# Altium schematic sheet Control_Schem.SchDoc (part 4 of 5)
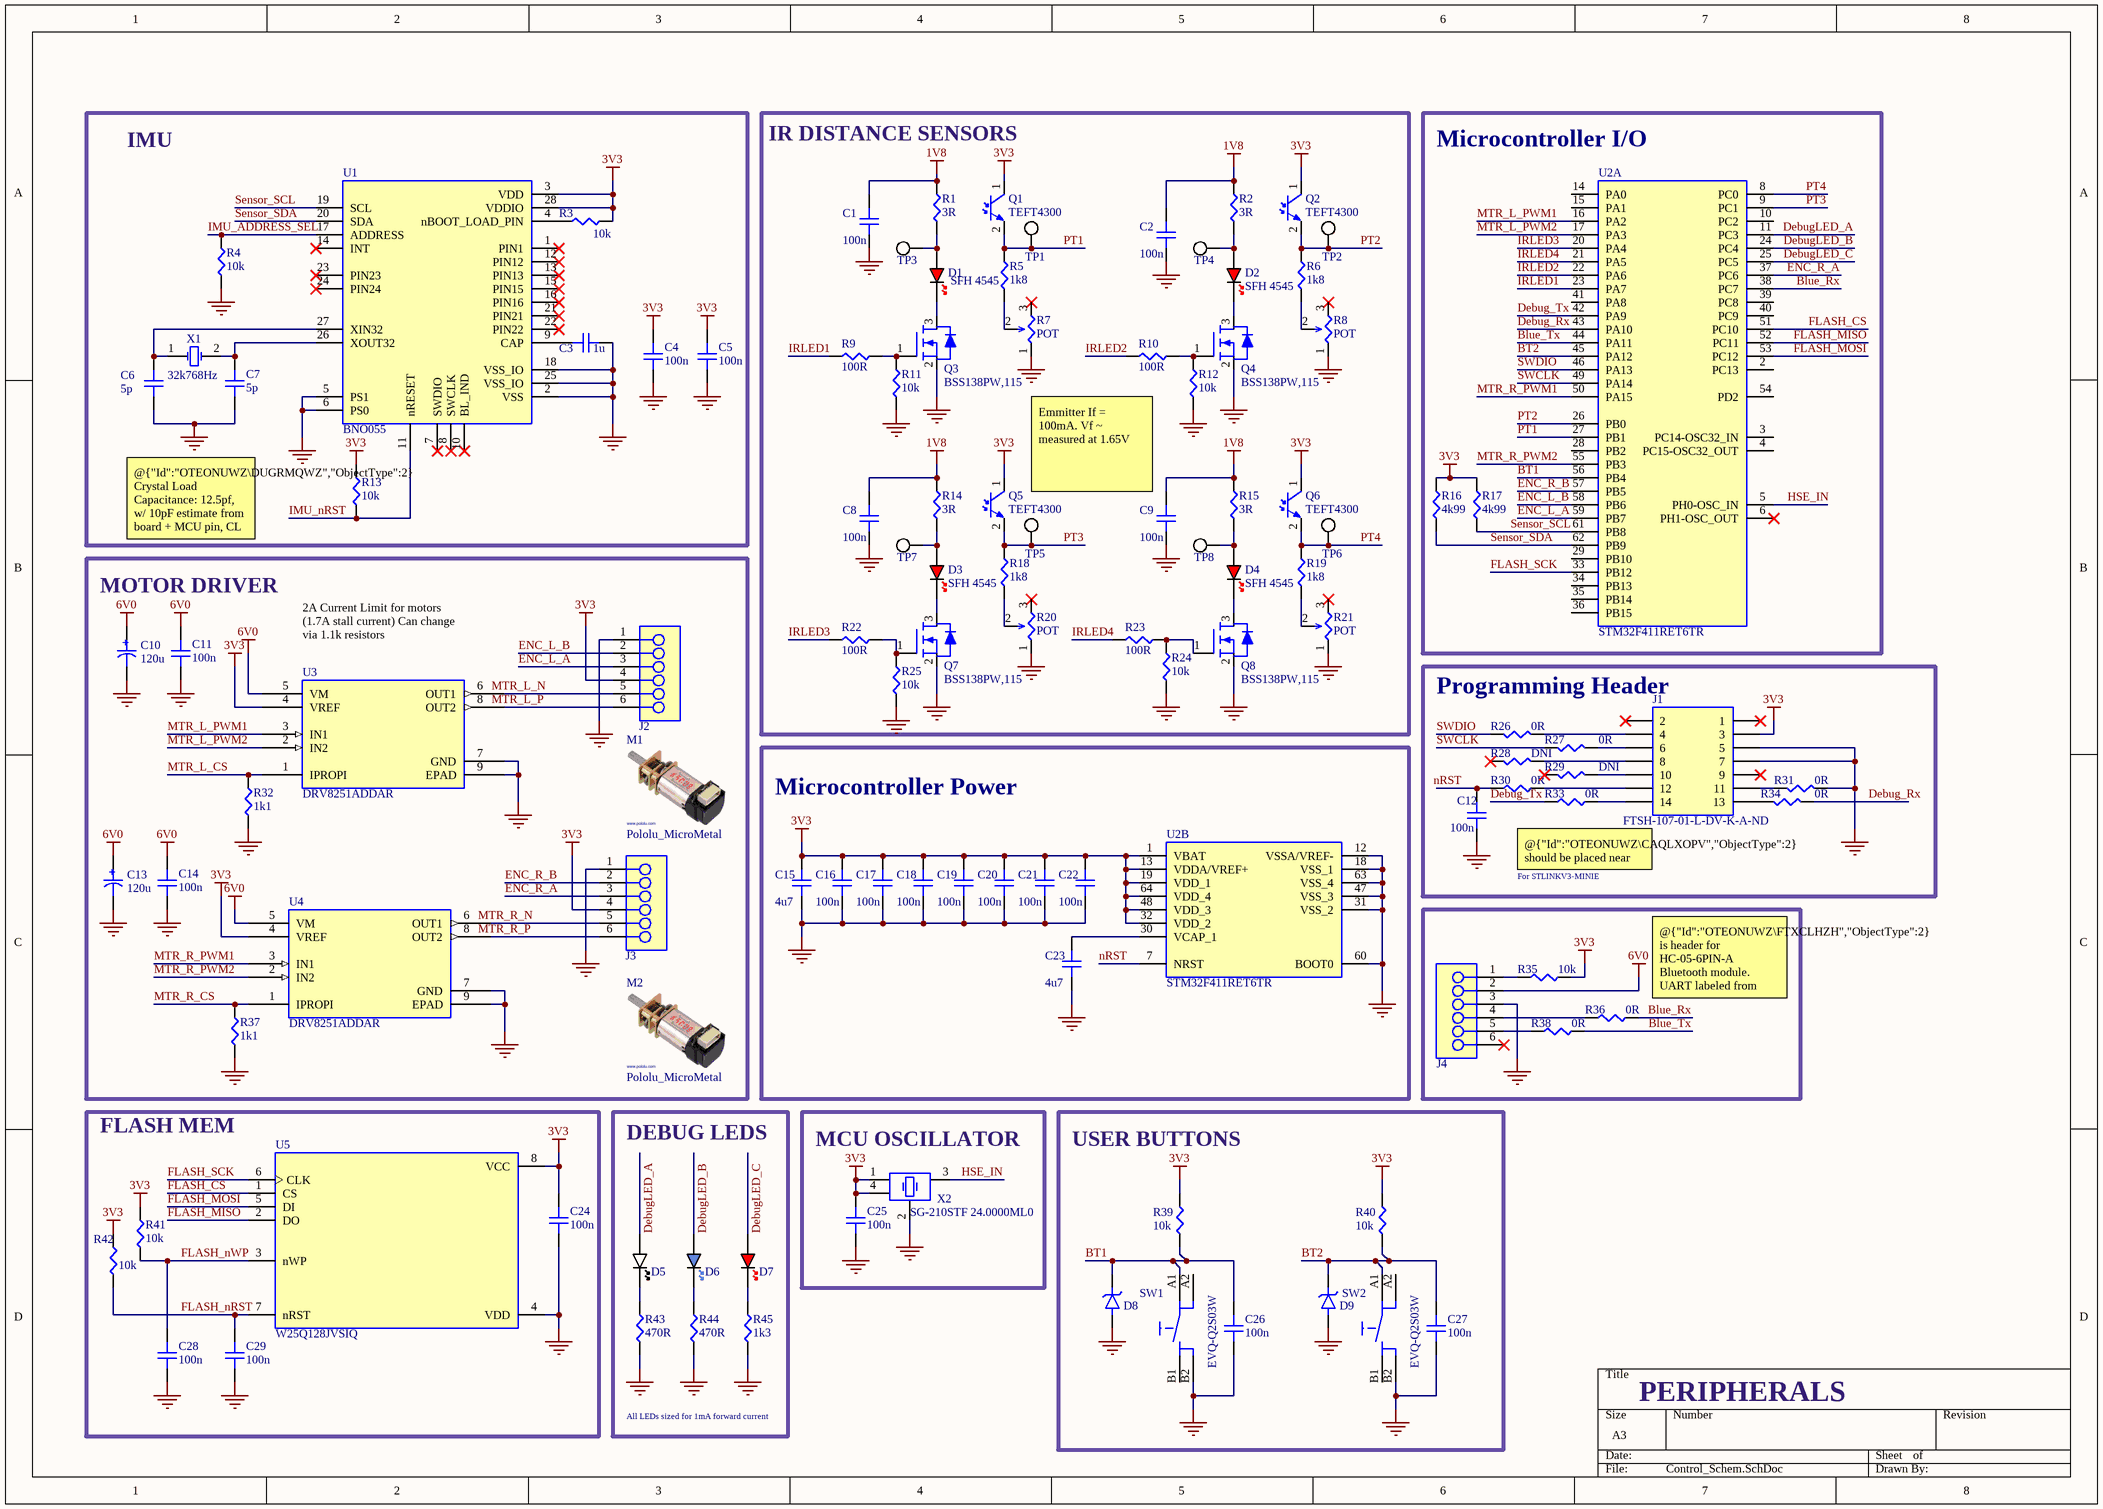
[diagram p3: Control_Schem.SchDoc]

## Library data of the parts (continued)
R35 = RES: 100mW Thick Film Resistors ±100ppm/℃ ±1% 10kΩ 0603 Chip Resistor - Surface Mount ROHS; Manufacturer: Stackpole Electronics; Manufacturer Part Number: RNCP0603FTD49R9; Max Power Dissipation: 125mW; Temperature Coefficient: 100ppm/°C; Voltage Rating: 150V; Voltage Rating (DC): 50V; Value: 10k; Supplier 1: Verical; Supplier Part Number: RNCP0603FTD49R9; RoHS: Compliant; Category: Chip SMD Resistors; Stock: 245000; Pricing: 5000=0.0152 (USD); Case/Package: 0603; Case Code (Imperial): 0603; Case Code (Metric): 1608; Composition: Thin Film; Features: Anti-Sulfur, Moisture Resistant; Height: 400µm; Lead Free: Lead Free; Length: 1.4986mm; Lifecycle Status: Production; Max Operating Temperature: 155°C; Min Operating Temperature: -55°C; Mounting Technology: Surface Mount; Number of Terminals: 2; Number of Terminations: 2; Packaging: Cut Tape (CT); Power Dissipation: 125mW; Power Rating: 125mW; REACH SVHC: Yes; Schedule B: 8533210045, 8533210045|8533210045, 8533210045|8533210045|8533210045, 8533210045|8533210045|8533210045|8533210045; Tolerance: 1%; Width: 800µm; Working Voltage: 150V; ComponentLink1URL: https://datasheet.octopart.com:443/RNCP0603FTD49R9-Stackpole-Electronics-datasheet-182148179.pdf?src-supplier=IHS; ComponentLink1Description: https://datasheet.octopart.com:443/RNCP0603FTD49R9-Stackpole-Electronics-datasheet-182148179.pdf?src-supplier=IHS; ComponentLink2URL: https://datasheet.octopart.com:443/RNCP0603FTD49R9-Stackpole-Electronics-datasheet-149178200.pdf?src-supplier=Upverter; ComponentLink2Description: https://datasheet.octopart.com:443/RNCP0603FTD49R9-Stackpole-Electronics-datasheet-149178200.pdf?src-supplier=Upverter; ComponentLink3URL: https://datasheet.octopart.com:443/RNCP0603FTD49R9-Stackpole-Electronics-datasheet-141193801.pdf?src-supplier=Future+Electronics; ComponentLink3Description: https://datasheet.octopart.com:443/RNCP0603FTD49R9-Stackpole-Electronics-datasheet-141193801.pdf?src-supplier=Future+Electronics; ComponentLink4URL: https://datasheet.octopart.com:443/RNCP0603FTD49R9-Stackpole-Electronics-datasheet-38896780.pdf?src-supplier=Future+Electronics; ComponentLink4Description: https://datasheet.octopart.com:443/RNCP0603FTD49R9-Stackpole-Electronics-datasheet-38896780.pdf?src-supplier=Future+Electronics; ComponentLink5URL: http://sigma.octopart.com:80/15942470/materials_sheet/Stackpole-Electronics-RNCP0603FTD49R9.pdf?src-supplier=Compliance+Statements; ComponentLink5Description: http://sigma.octopart.com:80/15942470/materials_sheet/Stackpole-Electronics-RNCP0603FTD49R9.pdf?src-supplier=Compliance+Statements; ComponentLink6URL: http://sigma.octopart.com:80/141158211/reach_statement/Stackpole-Electronics-RNCP0603FTD49R9.pdf?src-supplier=Compliance+Statements; ComponentLink6Description: http://sigma.octopart.com:80/141158211/reach_statement/Stackpole-Electronics-RNCP0603FTD49R9.pdf?src-supplier=Compliance+Statements; ComponentLink7URL: http://sigma.octopart.com:80/141158212/rohs_statement/Stackpole-Electronics-RNCP0603FTD49R9.pdf?src-supplier=Compliance+Statements; ComponentLink7Description: http://sigma.octopart.com:80/141158212/rohs_statement/Stackpole-Electronics-RNCP0603FTD49R9.pdf?src-supplier=Compliance+Statements; Supplier Part Number 1: RC0603FR-0710KL; China RoHS: Non-Compliant; Contact Plating: Tin; Depth: 800µm; Lead Pitch: 300µm; Military Standard: Not; Pins: 2; Radiation Hardening: No; Termination: SMD/SMT; Weight: 2.012816mg; ComponentLink8URL: https://datasheet.octopart.com:443/RC0603FR-0710KL-Yageo-datasheet-175887523.pdf?src-supplier=IHS; ComponentLink8Description: https://datasheet.octopart.com:443/RC0603FR-0710KL-Yageo-datasheet-175887523.pdf?src-supplier=IHS; ComponentLink9URL: https://datasheet.octopart.com:443/RC0603FR-0710KL-Yageo-datasheet-103092701.pdf?src-supplier=Upverter; ComponentLink9Description: https://datasheet.octopart.com:443/RC0603FR-0710KL-Yageo-datasheet-103092701.pdf?src-supplier=Upverter; ComponentLink10URL: https://datasheet.octopart.com:443/RC0603FR-0710KL-Yageo-datasheet-98239111.pdf?src-supplier=Upverter; ComponentLink10Description: https://datasheet.octopart.com:443/RC0603FR-0710KL-Yageo-datasheet-98239111.pdf?src-supplier=Upverter; ComponentLink11URL: https://datasheet.octopart.com:443/RC0603FR-0710KL-Yageo-datasheet-141265859.pdf?src-supplier=Upverter; ComponentLink11Description: https://datasheet.octopart.com:443/RC0603FR-0710KL-Yageo-datasheet-141265859.pdf?src-supplier=Upverter; ComponentLink12URL: https://sigma.octopart.com:443/138820526/technical_drawing/Yageo-RC0603FR-0710KL.pdf?src-supplier=Upverter; ComponentLink12Description: https://sigma.octopart.com:443/138820526/technical_drawing/Yageo-RC0603FR-0710KL.pdf?src-supplier=Upverter; ComponentLink13URL: https://datasheet.octopart.com:443/RC0603FR-0710KL-Yageo-datasheet-8328172.pdf?src-supplier=Farnell; ComponentLink13Description: https://datasheet.octopart.com:443/RC0603FR-0710KL-Yageo-datasheet-8328172.pdf?src-supplier=Farnell; ComponentLink14URL: https://datasheet.octopart.com:443/RC0603FR-0710KL-Yageo-datasheet-13691069.pdf?src-supplier=Farnell; ComponentLink14Description: https://datasheet.octopart.com:443/RC0603FR-0710KL-Yageo-datasheet-13691069.pdf?src-supplier=Farnell; ComponentLink15URL: https://datasheet.octopart.com:443/RC0603FR-0710KL-Yageo-datasheet-62067350.pdf?src-supplier=element14+APAC; ComponentLink15Description: https://datasheet.octopart.com:443/RC0603FR-0710KL-Yageo-datasheet-62067350.pdf?src-supplier=element14+APAC; ComponentLink16URL: https://datasheet.octopart.com:443/RC0603FR-0710KL-Yageo-datasheet-17842380.pdf?src-supplier=element14+APAC; ComponentLink16Description: https://datasheet.octopart.com:443/RC0603FR-0710KL-Yageo-datasheet-17842380.pdf?src-supplier=element14+APAC; ComponentLink17URL: https://datasheet.octopart.com:443/RC0603FR-0710KL-Yageo-datasheet-15599030.pdf?src-supplier=Future+Electronics; ComponentLink17Description: https://datasheet.octopart.com:443/RC0603FR-0710KL-Yageo-datasheet-15599030.pdf?src-supplier=Future+Electronics; ComponentLink18URL: https://datasheet.octopart.com:443/RC0603FR-0710KL-Yageo-Group-datasheet-176638170.pdf?src-supplier=Future+Electronics; ComponentLink18Description: https://datasheet.octopart.com:443/RC0603FR-0710KL-Yageo-Group-datasheet-176638170.pdf?src-supplier=Future+Electronics; ComponentLink19URL: https://datasheet.octopart.com:443/RC0603FR-0710KL-Yageo-datasheet-164759695.pdf?src-supplier=Future+Electronics; ComponentLink19Description: https://datasheet.octopart.com:443/RC0603FR-0710KL-Yageo-datasheet-164759695.pdf?src-supplier=Future+Electronics; ComponentLink20URL: https://datasheet.octopart.com:443/RC0603FR-0710KL-Yageo-datasheet-127823281.pdf?src-supplier=Future+Electronics; ComponentLink20Description: https://datasheet.octopart.com:443/RC0603FR-0710KL-Yageo-datasheet-127823281.pdf?src-supplier=Future+Electronics; ComponentLink21URL: https://datasheet.octopart.com:443/RC0603FR-0710KL-Yageo-datasheet-137700087.pdf?src-supplier=Future+Electronics; ComponentLink21Description: https://datasheet.octopart.com:443/RC0603FR-0710KL-Yageo-datasheet-137700087.pdf?src-supplier=Future+Electronics; ComponentLink22URL: https://datasheet.octopart.com:443/RC0603FR-0710KL-Yageo-datasheet-27584510.pdf?src-supplier=Future+Electronics; ComponentLink22Description: https://datasheet.octopart.com:443/RC0603FR-0710KL-Yageo-datasheet-27584510.pdf?src-supplier=Future+Electronics; ComponentLink23URL: https://datasheet.octopart.com:443/RC0603FR-0710KL-Yageo-datasheet-8324193.pdf?src-supplier=Future+Electronics; ComponentLink23Description: https://datasheet.octopart.com:443/RC0603FR-0710KL-Yageo-datasheet-8324193.pdf?src-supplier=Future+Electronics; ComponentLink24URL: https://datasheet.octopart.com:443/RC0603FR-0710KL-Yageo-datasheet-12596169.pdf?src-supplier=Newark; ComponentLink24Description: https://datasheet.octopart.com:443/RC0603FR-0710KL-Yageo-datasheet-12596169.pdf?src-supplier=Newark; ComponentLink25URL: https://datasheet.octopart.com:443/RC0603FR-0710KL-Yageo-datasheet-503470.pdf?src-supplier=Newark; ComponentLink25Description: https://datasheet.octopart.com:443/RC0603FR-0710KL-Yageo-datasheet-503470.pdf?src-supplier=Newark; ComponentLink26URL: https://datasheet.octopart.com:443/RC0603FR-0710KL-Yageo-datasheet-34211833.pdf?src-supplier=Newark; ComponentLink26Description: https://datasheet.octopart.com:443/RC0603FR-0710KL-Yageo-datasheet-34211833.pdf?src-supplier=Newark; ComponentLink27URL: https://datasheet.octopart.com:443/RC0603FR-0710KL-Yageo-datasheet-79472498.pdf?src-supplier=Megastar; ComponentLink27Description: https://datasheet.octopart.com:443/RC0603FR-0710KL-Yageo-datasheet-79472498.pdf?src-supplier=Megastar; ComponentLink28URL: https://datasheet.octopart.com/RC0603FR-0710KL-Yageo-datasheet-73766026.pdf; ComponentLink28Description: https://datasheet.octopart.com/RC0603FR-0710KL-Yageo-datasheet-73766026.pdf; ComponentLink29URL: https://datasheet.octopart.com:443/RC0603FR-0710KL-Yageo-datasheet-118562.pdf?src-supplier=DigiKey; ComponentLink29Description: https://datasheet.octopart.com:443/RC0603FR-0710KL-Yageo-datasheet-118562.pdf?src-supplier=DigiKey; ComponentLink30URL: http://sigma.octopart.com:80/conflict_mineral_statement/Yageo-company-3.pdf?src-supplier=Compliance+Statements; ComponentLink30Description: http://sigma.octopart.com:80/conflict_mineral_statement/Yageo-company-3.pdf?src-supplier=Compliance+Statements; ComponentLink31URL: http://sigma.octopart.com:80/rohs_statement/Yageo-company-2.pdf?src-supplier=Compliance+Statements; ComponentLink31Description: http://sigma.octopart.com:80/rohs_statement/Yageo-company-2.pdf?src-supplier=Compliance+Statements
R36 R38 = RES: GENERAL PURPOSE CHIP RESISTOR Metal Glaze/thick Film, 0.1W, 0ohm, Surface Mount, 0603; Manufacturer: Stackpole Electronics; Manufacturer Part Number: RNCP0603FTD49R9; Max Power Dissipation: 125mW; Temperature Coefficient: 100ppm/°C; Tolerance: 1%; Voltage Rating: 150V; Voltage Rating (DC): 50V; Value: 0R; Supplier 1: Verical; Supplier Part Number: RNCP0603FTD49R9; RoHS: Compliant; Category: Chip SMD Resistors; Stock: 245000; Pricing: 5000=0.0152 (USD); Case/Package: 0603; Case Code (Imperial): 0603; Case Code (Metric): 1608; Composition: Thin Film; Features: Anti-Sulfur, Moisture Resistant; Height: 400µm; Lead Free: Lead Free; Length: 1.4986mm; Lifecycle Status: Production; Max Operating Temperature: 155°C; Min Operating Temperature: -55°C; Mounting Technology: Surface Mount; Number of Terminals: 2; Number of Terminations: 2; Packaging: Cut Tape (CT); Power Dissipation: 125mW; Power Rating: 125mW; REACH SVHC: Yes; Schedule B: 8533210045, 8533210045|8533210045, 8533210045|8533210045|8533210045, 8533210045|8533210045|8533210045|8533210045; Width: 800µm; Working Voltage: 150V; ComponentLink1URL: https://datasheet.octopart.com:443/RNCP0603FTD49R9-Stackpole-Electronics-datasheet-182148179.pdf?src-supplier=IHS; ComponentLink1Description: https://datasheet.octopart.com:443/RNCP0603FTD49R9-Stackpole-Electronics-datasheet-182148179.pdf?src-supplier=IHS; ComponentLink2URL: https://datasheet.octopart.com:443/RNCP0603FTD49R9-Stackpole-Electronics-datasheet-149178200.pdf?src-supplier=Upverter; ComponentLink2Description: https://datasheet.octopart.com:443/RNCP0603FTD49R9-Stackpole-Electronics-datasheet-149178200.pdf?src-supplier=Upverter; ComponentLink3URL: https://datasheet.octopart.com:443/RNCP0603FTD49R9-Stackpole-Electronics-datasheet-141193801.pdf?src-supplier=Future+Electronics; ComponentLink3Description: https://datasheet.octopart.com:443/RNCP0603FTD49R9-Stackpole-Electronics-datasheet-141193801.pdf?src-supplier=Future+Electronics; ComponentLink4URL: https://datasheet.octopart.com:443/RNCP0603FTD49R9-Stackpole-Electronics-datasheet-38896780.pdf?src-supplier=Future+Electronics; ComponentLink4Description: https://datasheet.octopart.com:443/RNCP0603FTD49R9-Stackpole-Electronics-datasheet-38896780.pdf?src-supplier=Future+Electronics; ComponentLink5URL: http://sigma.octopart.com:80/15942470/materials_sheet/Stackpole-Electronics-RNCP0603FTD49R9.pdf?src-supplier=Compliance+Statements; ComponentLink5Description: http://sigma.octopart.com:80/15942470/materials_sheet/Stackpole-Electronics-RNCP0603FTD49R9.pdf?src-supplier=Compliance+Statements; ComponentLink6URL: http://sigma.octopart.com:80/141158211/reach_statement/Stackpole-Electronics-RNCP0603FTD49R9.pdf?src-supplier=Compliance+Statements; ComponentLink6Description: http://sigma.octopart.com:80/141158211/reach_statement/Stackpole-Electronics-RNCP0603FTD49R9.pdf?src-supplier=Compliance+Statements; ComponentLink7URL: http://sigma.octopart.com:80/141158212/rohs_statement/Stackpole-Electronics-RNCP0603FTD49R9.pdf?src-supplier=Compliance+Statements; ComponentLink7Description: http://sigma.octopart.com:80/141158212/rohs_statement/Stackpole-Electronics-RNCP0603FTD49R9.pdf?src-supplier=Compliance+Statements; Supplier Part Number 1: RC0603JR-070RL; China RoHS: Non-Compliant; Contact Plating: Tin; Country of Origin: Mainland China, Taiwan; Depth: 800µm; Export Control Classification Number (ECCN) Code: EAR99; Harmonized Tariff Schedule (HTS) Code: 8533.21.00.30; Introduction Date: 2001-06-08; Military Standard: Not; Pins: 2; Radiation Hardening: No; Termination: SMD/SMT; ComponentLink8URL: https://datasheet.octopart.com:443/RC0603JR-070RL-Yageo-datasheet-182189538.pdf?src-supplier=IHS; ComponentLink8Description: https://datasheet.octopart.com:443/RC0603JR-070RL-Yageo-datasheet-182189538.pdf?src-supplier=IHS; ComponentLink9URL: https://datasheet.octopart.com:443/RC0603JR-070RL-Yageo-datasheet-8328172.pdf?src-supplier=element14+APAC; ComponentLink9Description: https://datasheet.octopart.com:443/RC0603JR-070RL-Yageo-datasheet-8328172.pdf?src-supplier=element14+APAC; ComponentLink10URL: https://datasheet.octopart.com:443/RC0603JR-070RL-Yageo-datasheet-17842380.pdf?src-supplier=element14+APAC; ComponentLink10Description: https://datasheet.octopart.com:443/RC0603JR-070RL-Yageo-datasheet-17842380.pdf?src-supplier=element14+APAC; ComponentLink11URL: https://datasheet.octopart.com:443/RC0603JR-070RL-Yageo-Group-datasheet-190305687.pdf?src-supplier=Newark; ComponentLink11Description: https://datasheet.octopart.com:443/RC0603JR-070RL-Yageo-Group-datasheet-190305687.pdf?src-supplier=Newark; ComponentLink12URL: https://datasheet.octopart.com:443/RC0603JR-070RL-Yageo-datasheet-12596169.pdf?src-supplier=Newark; ComponentLink12Description: https://datasheet.octopart.com:443/RC0603JR-070RL-Yageo-datasheet-12596169.pdf?src-supplier=Newark; ComponentLink13URL: https://datasheet.octopart.com:443/RC0603JR-070RL-Yageo-datasheet-34211833.pdf?src-supplier=Newark; ComponentLink13Description: https://datasheet.octopart.com:443/RC0603JR-070RL-Yageo-datasheet-34211833.pdf?src-supplier=Newark; ComponentLink14URL: https://datasheet.octopart.com:443/RC0603JR-070RL-Yageo-datasheet-62067350.pdf?src-supplier=Farnell; ComponentLink14Description: https://datasheet.octopart.com:443/RC0603JR-070RL-Yageo-datasheet-62067350.pdf?src-supplier=Farnell; ComponentLink15URL: https://datasheet.octopart.com:443/RC0603JR-070RL-Yageo-datasheet-15599030.pdf?src-supplier=Future+Electronics; ComponentLink15Description: https://datasheet.octopart.com:443/RC0603JR-070RL-Yageo-datasheet-15599030.pdf?src-supplier=Future+Electronics; ComponentLink16URL: https://datasheet.octopart.com:443/RC0603JR-070RL-Yageo-Group-datasheet-176638170.pdf?src-supplier=Future+Electronics; ComponentLink16Description: https://datasheet.octopart.com:443/RC0603JR-070RL-Yageo-Group-datasheet-176638170.pdf?src-supplier=Future+Electronics; ComponentLink17URL: https://datasheet.octopart.com:443/RC0603JR-070RL-Yageo-datasheet-164759695.pdf?src-supplier=Future+Electronics; ComponentLink17Description: https://datasheet.octopart.com:443/RC0603JR-070RL-Yageo-datasheet-164759695.pdf?src-supplier=Future+Electronics; ComponentLink18URL: https://datasheet.octopart.com:443/RC0603JR-070RL-Yageo-datasheet-137700087.pdf?src-supplier=Future+Electronics; ComponentLink18Description: https://datasheet.octopart.com:443/RC0603JR-070RL-Yageo-datasheet-137700087.pdf?src-supplier=Future+Electronics; ComponentLink19URL: https://datasheet.octopart.com:443/RC0603JR-070RL-Yageo-datasheet-27584510.pdf?src-supplier=Future+Electronics; ComponentLink19Description: https://datasheet.octopart.com:443/RC0603JR-070RL-Yageo-datasheet-27584510.pdf?src-supplier=Future+Electronics; ComponentLink20URL: https://datasheet.octopart.com:443/RC0603JR-070RL-Yageo-datasheet-503470.pdf?src-supplier=Future+Electronics; ComponentLink20Description: https://datasheet.octopart.com:443/RC0603JR-070RL-Yageo-datasheet-503470.pdf?src-supplier=Future+Electronics; ComponentLink21URL: https://datasheet.octopart.com:443/RC0603JR-070RL-Yageo-datasheet-79472498.pdf?src-supplier=Megastar; ComponentLink21Description: https://datasheet.octopart.com:443/RC0603JR-070RL-Yageo-datasheet-79472498.pdf?src-supplier=Megastar; ComponentLink22URL: https://datasheet.octopart.com/RC0603JR-070RL-Yageo-datasheet-73766026.pdf; ComponentLink22Description: https://datasheet.octopart.com/RC0603JR-070RL-Yageo-datasheet-73766026.pdf; ComponentLink23URL: https://datasheet.octopart.com:443/RC0603JR-070RL-Yageo-datasheet-5393049.pdf?src-supplier=element14; ComponentLink23Description: https://datasheet.octopart.com:443/RC0603JR-070RL-Yageo-datasheet-5393049.pdf?src-supplier=element14; ComponentLink24URL: https://datasheet.octopart.com:443/RC0603JR-070RL-Yageo-datasheet-118562.pdf?src-supplier=DigiKey; ComponentLink24Description: https://datasheet.octopart.com:443/RC0603JR-070RL-Yageo-datasheet-118562.pdf?src-supplier=DigiKey; ComponentLink25URL: http://sigma.octopart.com:80/conflict_mineral_statement/Yageo-company-3.pdf?src-supplier=Compliance+Statements; ComponentLink25Description: http://sigma.octopart.com:80/conflict_mineral_statement/Yageo-company-3.pdf?src-supplier=Compliance+Statements; ComponentLink26URL: http://sigma.octopart.com:80/rohs_statement/Yageo-company-2.pdf?src-supplier=Compliance+Statements; ComponentLink26Description: http://sigma.octopart.com:80/rohs_statement/Yageo-company-2.pdf?src-supplier=Compliance+Statements
R43 R44 = RES: Res Thick Film 0603 470 Ohm 1% 0.1W(1/10W) ±100ppm/C Pad SMD T/R; Manufacturer: Yageo Group; Manufacturer Part Number: RC0603FR-07470RL; Impedance: 50Ω; Max Power Dissipation: 100mW; Temperature Coefficient: 100ppm/°C; Voltage Rating: 75V; Voltage Rating (DC): 50V; Value: 470R; Supplier 1: Avnet; Supplier Part Number 1: RC0603FR-07470RL; RoHS: Compliant; Category: Chip SMD Resistors; Stock: 510000; Pricing: 5000=0.00137, 10000=0.00137, 20000=0.00136, 40000=0.00135, 80000=0.00134 (USD); Case/Package: 0603; Case Code (Imperial): 0603; Case Code (Metric): 0603; China RoHS: Non-Compliant; Composition: Thick Film; Contact Material: Brass; Contact Plating: Gold; Depth: 800µm; Features: Moisture Resistant; Height: 450µm; Lead Free: Lead Free; Length: 1.6mm; Lifecycle Status: Production; Max Operating Temperature: 155°C; Military Standard: Not; Min Operating Temperature: -55°C; Mounting Technology: Surface Mount; Pins: 2; Number of Terminals: 2; Number of Terminations: 2; Packaging: Tape and Reel; Power Rating: 100mW; Radiation Hardening: No; REACH SVHC: Yes; Schedule B: 8533210045, 8533210045|8533210045, 8533210045|8533210045|8533210045, 8533210045|8533210045|8533210045|8533210045; Termination: SMD/SMT; Tolerance: 1%; Width: 800µm; Working Voltage: 75V; ComponentLink1URL: https://datasheet.octopart.com:443/RC0603FR-07470RL-Yageo-datasheet-175887523.pdf?src-supplier=Newark; ComponentLink1Description: https://datasheet.octopart.com:443/RC0603FR-07470RL-Yageo-datasheet-175887523.pdf?src-supplier=Newark; ComponentLink2URL: https://datasheet.octopart.com:443/RC0603FR-07470RL-Yageo-datasheet-8328172.pdf?src-supplier=Newark; ComponentLink2Description: https://datasheet.octopart.com:443/RC0603FR-07470RL-Yageo-datasheet-8328172.pdf?src-supplier=Newark; ComponentLink3URL: https://datasheet.octopart.com:443/RC0603FR-07470RL-Yageo-Group-datasheet-190051977.pdf?src-supplier=Newark; ComponentLink3Description: https://datasheet.octopart.com:443/RC0603FR-07470RL-Yageo-Group-datasheet-190051977.pdf?src-supplier=Newark; ComponentLink4URL: https://datasheet.octopart.com:443/RC0603FR-07470RL-Yageo-datasheet-12596169.pdf?src-supplier=Newark; ComponentLink4Description: https://datasheet.octopart.com:443/RC0603FR-07470RL-Yageo-datasheet-12596169.pdf?src-supplier=Newark; ComponentLink5URL: https://datasheet.octopart.com:443/RC0603FR-07470RL-Yageo-datasheet-103092701.pdf?src-supplier=Upverter; ComponentLink5Description: https://datasheet.octopart.com:443/RC0603FR-07470RL-Yageo-datasheet-103092701.pdf?src-supplier=Upverter; ComponentLink6URL: https://datasheet.octopart.com:443/RC0603FR-07470RL-Yageo-datasheet-98239111.pdf?src-supplier=Upverter; ComponentLink6Description: https://datasheet.octopart.com:443/RC0603FR-07470RL-Yageo-datasheet-98239111.pdf?src-supplier=Upverter; ComponentLink7URL: https://datasheet.octopart.com:443/RC0603FR-07470RL-Yageo-datasheet-34211833.pdf?src-supplier=element14+APAC; ComponentLink7Description: https://datasheet.octopart.com:443/RC0603FR-07470RL-Yageo-datasheet-34211833.pdf?src-supplier=element14+APAC; ComponentLink8URL: https://datasheet.octopart.com:443/RC0603FR-07470RL-Yageo-datasheet-17842380.pdf?src-supplier=element14+APAC; ComponentLink8Description: https://datasheet.octopart.com:443/RC0603FR-07470RL-Yageo-datasheet-17842380.pdf?src-supplier=element14+APAC; ComponentLink9URL: https://datasheet.octopart.com:443/RC0603FR-07470RL-Yageo-datasheet-62067350.pdf?src-supplier=Farnell; ComponentLink9Description: https://datasheet.octopart.com:443/RC0603FR-07470RL-Yageo-datasheet-62067350.pdf?src-supplier=Farnell; ComponentLink10URL: https://datasheet.octopart.com:443/RC0603FR-07470RL-Yageo-datasheet-13691069.pdf?src-supplier=Farnell; ComponentLink10Description: https://datasheet.octopart.com:443/RC0603FR-07470RL-Yageo-datasheet-13691069.pdf?src-supplier=Farnell; ComponentLink11URL: https://datasheet.octopart.com:443/RC0603FR-07470RL-Yageo-Group-datasheet-176638170.pdf?src-supplier=Future+Electronics; ComponentLink11Description: https://datasheet.octopart.com:443/RC0603FR-07470RL-Yageo-Group-datasheet-176638170.pdf?src-supplier=Future+Electronics; ComponentLink12URL: https://datasheet.octopart.com:443/RC0603FR-07470RL-Yageo-datasheet-164759695.pdf?src-supplier=Future+Electronics; ComponentLink12Description: https://datasheet.octopart.com:443/RC0603FR-07470RL-Yageo-datasheet-164759695.pdf?src-supplier=Future+Electronics; ComponentLink13URL: https://datasheet.octopart.com:443/RC0603FR-07470RL-Yageo-datasheet-137700087.pdf?src-supplier=Future+Electronics; ComponentLink13Description: https://datasheet.octopart.com:443/RC0603FR-07470RL-Yageo-datasheet-137700087.pdf?src-supplier=Future+Electronics; ComponentLink14URL: https://datasheet.octopart.com:443/RC0603FR-07470RL-Yageo-datasheet-127823281.pdf?src-supplier=Future+Electronics; ComponentLink14Description: https://datasheet.octopart.com:443/RC0603FR-07470RL-Yageo-datasheet-127823281.pdf?src-supplier=Future+Electronics; ComponentLink15URL: https://datasheet.octopart.com:443/RC0603FR-07470RL-Yageo-datasheet-27584510.pdf?src-supplier=Future+Electronics; ComponentLink15Description: https://datasheet.octopart.com:443/RC0603FR-07470RL-Yageo-datasheet-27584510.pdf?src-supplier=Future+Electronics; ComponentLink16URL: https://datasheet.octopart.com:443/RC0603FR-07470RL-Yageo-datasheet-15599030.pdf?src-supplier=Future+Electronics; ComponentLink16Description: https://datasheet.octopart.com:443/RC0603FR-07470RL-Yageo-datasheet-15599030.pdf?src-supplier=Future+Electronics; ComponentLink17URL: https://datasheet.octopart.com:443/RC0603FR-07470RL-Yageo-datasheet-503470.pdf?src-supplier=Future+Electronics; ComponentLink17Description: https://datasheet.octopart.com:443/RC0603FR-07470RL-Yageo-datasheet-503470.pdf?src-supplier=Future+Electronics; ComponentLink18URL: https://datasheet.octopart.com:443/RC0603FR-07470RL-Yageo-datasheet-79472498.pdf?src-supplier=Megastar; ComponentLink18Description: https://datasheet.octopart.com:443/RC0603FR-07470RL-Yageo-datasheet-79472498.pdf?src-supplier=Megastar; ComponentLink19URL: https://datasheet.octopart.com/RC0603FR-07470RL-Yageo-datasheet-73766026.pdf; ComponentLink19Description: https://datasheet.octopart.com/RC0603FR-07470RL-Yageo-datasheet-73766026.pdf; ComponentLink20URL: https://datasheet.octopart.com:443/RC0603FR-07470RL-Yageo-datasheet-118562.pdf?src-supplier=DigiKey; ComponentLink20Description: https://datasheet.octopart.com:443/RC0603FR-07470RL-Yageo-datasheet-118562.pdf?src-supplier=DigiKey; ComponentLink21URL: http://sigma.octopart.com:80/conflict_mineral_statement/Yageo-company-3.pdf?src-supplier=Compliance+Statements; ComponentLink21Description: http://sigma.octopart.com:80/conflict_mineral_statement/Yageo-company-3.pdf?src-supplier=Compliance+Statements; ComponentLink22URL: http://sigma.octopart.com:80/rohs_statement/Yageo-company-2.pdf?src-supplier=Compliance+Statements; ComponentLink22Description: http://sigma.octopart.com:80/rohs_statement/Yageo-company-2.pdf?src-supplier=Compliance+Statements
R45 = RES: 100mW Thick Film Resistors 75V ±100ppm/℃ ±5% 1.3kΩ 0603 Chip Resistor - Surface Mount ROHS; Manufacturer: Yageo Group; Manufacturer Part Number: RC0603JR-071K3L; Temperature Coefficient: 100ppm/°C; Voltage Rating: 50V; Value: 1k3; Supplier 1: Avnet; Supplier Part Number 1: 49AK2937; RoHS: Compliant; Category: Chip SMD Resistors; Stock: 4972; Pricing: 1=0.103, 25=0.007, 100=0.006, 500=0.005 (USD); Case/Package: 0603; Case Code (Imperial): 0603; China RoHS: Non-Compliant; Composition: Thick Film; Contact Plating: Tin; Depth: 800µm; Features: Moisture Resistant; Height: 450µm; Lead Free: Lead Free; Length: 1.6mm; Lifecycle Status: Production; Max Operating Temperature: 155°C; Max Power Dissipation: 100mW; Military Standard: Not; Min Operating Temperature: -55°C; Mounting Technology: Surface Mount; Number of Terminals: 2; Number of Terminations: 2; Power Rating: 100mW; Radiation Hardening: No; REACH SVHC: Yes; Schedule B: 8533210045, 8533210045|8533210045|8533210045|8533210045|8533210045; Termination: SMD/SMT; Tolerance: 5%; Voltage Rating (DC): 50V; Width: 800µm; Working Voltage: 75V; ComponentLink1URL: https://datasheet.octopart.com:443/RC0603JR-071K3L-Yageo-datasheet-175887523.pdf?src-supplier=Newark; ComponentLink1Description: https://datasheet.octopart.com:443/RC0603JR-071K3L-Yageo-datasheet-175887523.pdf?src-supplier=Newark; ComponentLink2URL: https://datasheet.octopart.com:443/RC0603JR-071K3L-Yageo-datasheet-8328172.pdf?src-supplier=Future+Electronics; ComponentLink2Description: https://datasheet.octopart.com:443/RC0603JR-071K3L-Yageo-datasheet-8328172.pdf?src-supplier=Future+Electronics; ComponentLink3URL: https://datasheet.octopart.com:443/RC0603JR-071K3L-Yageo-Group-datasheet-176638170.pdf?src-supplier=Future+Electronics; ComponentLink3Description: https://datasheet.octopart.com:443/RC0603JR-071K3L-Yageo-Group-datasheet-176638170.pdf?src-supplier=Future+Electronics; ComponentLink4URL: https://datasheet.octopart.com:443/RC0603JR-071K3L-Yageo-datasheet-164759695.pdf?src-supplier=Future+Electronics; ComponentLink4Description: https://datasheet.octopart.com:443/RC0603JR-071K3L-Yageo-datasheet-164759695.pdf?src-supplier=Future+Electronics; ComponentLink5URL: https://datasheet.octopart.com:443/RC0603JR-071K3L-Yageo-datasheet-137700087.pdf?src-supplier=Future+Electronics; ComponentLink5Description: https://datasheet.octopart.com:443/RC0603JR-071K3L-Yageo-datasheet-137700087.pdf?src-supplier=Future+Electronics; ComponentLink6URL: https://datasheet.octopart.com:443/RC0603JR-071K3L-Yageo-datasheet-27584510.pdf?src-supplier=Future+Electronics; ComponentLink6Description: https://datasheet.octopart.com:443/RC0603JR-071K3L-Yageo-datasheet-27584510.pdf?src-supplier=Future+Electronics; ComponentLink7URL: https://datasheet.octopart.com:443/RC0603JR-071K3L-Yageo-datasheet-15599030.pdf?src-supplier=Future+Electronics; ComponentLink7Description: https://datasheet.octopart.com:443/RC0603JR-071K3L-Yageo-datasheet-15599030.pdf?src-supplier=Future+Electronics; ComponentLink8URL: https://datasheet.octopart.com:443/RC0603JR-071K3L-Yageo-datasheet-12596169.pdf?src-supplier=Future+Electronics; ComponentLink8Description: https://datasheet.octopart.com:443/RC0603JR-071K3L-Yageo-datasheet-12596169.pdf?src-supplier=Future+Electronics; ComponentLink9URL: https://datasheet.octopart.com/RC0603JR-071K3L-Yageo-datasheet-73766026.pdf; ComponentLink9Description: https://datasheet.octopart.com/RC0603JR-071K3L-Yageo-datasheet-73766026.pdf; ComponentLink10URL: https://datasheet.octopart.com:443/RC0603JR-071K3L-Yageo-datasheet-118562.pdf?src-supplier=DigiKey; ComponentLink10Description: https://datasheet.octopart.com:443/RC0603JR-071K3L-Yageo-datasheet-118562.pdf?src-supplier=DigiKey; ComponentLink11URL: http://sigma.octopart.com:80/conflict_mineral_statement/Yageo-company-3.pdf?src-supplier=Compliance+Statements; ComponentLink11Description: http://sigma.octopart.com:80/conflict_mineral_statement/Yageo-company-3.pdf?src-supplier=Compliance+Statements; ComponentLink12URL: http://sigma.octopart.com:80/rohs_statement/Yageo-company-2.pdf?src-supplier=Compliance+Statements; ComponentLink12Description: http://sigma.octopart.com:80/rohs_statement/Yageo-company-2.pdf?src-supplier=Compliance+Statements
SW1 SW2 = SW: Switch Tactile ON OFF SPST Round Button J-Bend 0.02A 15VDC 1.6N SMD Embossed T/R; Manufacturer_Name: Panasonic; Geometry.Height: 3.3mm; Actuator Length: 1.3mm; Contact Current Rating: 20mA; Contact Resistance: 100mΩ; Electrical Life: 1Mcycles; Illumination Type: Illuminated, Non-Illuminated; Max Voltage Rating (DC): 15V; Number of Positions: 1; Switch Function: Off-Mom; Switch Travel: 250µm; Voltage Rating (AC): 250V; Mouser Part Number: 667-EVQ-Q2S03W; Mouser Price/Stock: https://www.mouser.co.uk/ProductDetail/Panasonic/EVQ-Q2S03W?qs=WwqriLBepZso3gwmd6qd3A%3D%3D; Manufacturer_Part_Number: EVQ-Q2S03W; Datasheet Link: https://componentsearchengine.com/Datasheets/1/EVQ-Q2S03W.pdf; Supplier 1: Verical; Supplier Part Number 1: EVQ-Q2S03W; Manufacturer: Panasonic; Manufacturer Part Number: EVQ-Q2S03W; RoHS: Compliant; Category: Tactile Switches; Stock: 20000; Pricing: 2000=0.1459, 4000=0.1396, 6000=0.1359, 8000=0.1332 (USD); Case/Package: SMD/SMT; Color: White; Contact Plating: Silver; Current Rating: 20mA; Depth: 6.6mm; Height: 1.8mm; Insulation Resistance: 100MΩ; Lead Free: Lead Free; Length: 6.5mm; Life (Cycles): 1Mcycles; Lifecycle Status: Production; Max Current Rating: 20mA; Max Operating Temperature: 85°C; Mechanical Life: 1Mcycles; Min Operating Temperature: -40°C; Mounting Technology: Surface Mount; Operating Force: 1.6N; Radiation Hardening: No; REACH SVHC: Yes; Termination: SMD/SMT; Thickness: 1.8mm; Throw Configuration: SPST; Voltage Rating (DC): 15V; Width: 6mm; ComponentLink1URL: https://datasheet.octopart.com:443/EVQQ2S03W-Panasonic-datasheet-138897726.pdf?src-supplier=Upverter; ComponentLink1Description: https://datasheet.octopart.com:443/EVQQ2S03W-Panasonic-datasheet-138897726.pdf?src-supplier=Upverter; ComponentLink2URL: https://datasheet.octopart.com:443/EVQ-Q2S03W-Panasonic-datasheet-59328990.pdf?src-supplier=IHS; ComponentLink2Description: https://datasheet.octopart.com:443/EVQ-Q2S03W-Panasonic-datasheet-59328990.pdf?src-supplier=IHS; ComponentLink3URL: https://datasheet.octopart.com/EVQ-Q2S03W-Panasonic-datasheet-13267673.pdf; ComponentLink3Description: https://datasheet.octopart.com/EVQ-Q2S03W-Panasonic-datasheet-13267673.pdf; ComponentLink4URL: https://datasheet.octopart.com:443/EVQ-Q2S03W-Panasonic-datasheet-130260655.pdf?src-supplier=TME; ComponentLink4Description: https://datasheet.octopart.com:443/EVQ-Q2S03W-Panasonic-datasheet-130260655.pdf?src-supplier=TME; ComponentLink5URL: https://datasheet.octopart.com:443/EVQ-Q2S03W-Panasonic-datasheet-41178988.pdf?src-supplier=Farnell; ComponentLink5Description: https://datasheet.octopart.com:443/EVQ-Q2S03W-Panasonic-datasheet-41178988.pdf?src-supplier=Farnell; ComponentLink6URL: https://datasheet.octopart.com:443/EVQQ2S03W-Panasonic-datasheet-5314136.pdf?src-supplier=Farnell; ComponentLink6Description: https://datasheet.octopart.com:443/EVQQ2S03W-Panasonic-datasheet-5314136.pdf?src-supplier=Farnell; ComponentLink7URL: https://datasheet.octopart.com:443/EVQ-Q2S03W-Panasonic-datasheet-106547821.pdf?src-supplier=Future+Electronics; ComponentLink7Description: https://datasheet.octopart.com:443/EVQ-Q2S03W-Panasonic-datasheet-106547821.pdf?src-supplier=Future+Electronics; ComponentLink8URL: https://datasheet.octopart.com:443/EVQQ2S03W-Panasonic-datasheet-169147451.pdf?src-supplier=Future+Electronics; ComponentLink8Description: https://datasheet.octopart.com:443/EVQQ2S03W-Panasonic-datasheet-169147451.pdf?src-supplier=Future+Electronics; ComponentLink9URL: https://datasheet.octopart.com:443/EVQ-Q2S03W-Panasonic-datasheet-98950118.pdf?src-supplier=Future+Electronics; ComponentLink9Description: https://datasheet.octopart.com:443/EVQ-Q2S03W-Panasonic-datasheet-98950118.pdf?src-supplier=Future+Electronics; ComponentLink10URL: https://datasheet.octopart.com:443/EVQ-Q2S03W-Panasonic-datasheet-118699.pdf?src-supplier=DigiKey; ComponentLink10Description: https://datasheet.octopart.com:443/EVQ-Q2S03W-Panasonic-datasheet-118699.pdf?src-supplier=DigiKey
U1 = BNO055: IMU ACCEL/GYRO/MAG I2C 28LGA / Intelligent 9-axis absolute orientation sensor; Manufacturer: Bosch Sensortec; Interface: I2C, UART; Max Supply Voltage: 3.6V; Min Supply Voltage: 1.7V; Operating Supply Current: 12.3mA; Package: None; Price: None; Value: *; MP: BNO055; Availability: Unavailable; Manufacturer Part Number: BNO055; RoHS: Compliant; Category: Inertial Measurement Units (IMUs); Pricing: 4000=10.57 (USD); Ambient Temperature Range High: 85°C; Height: 1.18mm; Max Operating Temperature: 85°C; Min Operating Temperature: -40°C; Pins: 2; ComponentLink1URL: https://datasheet.octopart.com:443/BNO055-Bosch-Sensortec-datasheet-127364294.pdf?src-supplier=LKR; ComponentLink1Description: https://datasheet.octopart.com:443/BNO055-Bosch-Sensortec-datasheet-127364294.pdf?src-supplier=LKR; ComponentLink2URL: https://sigma.octopart.com:443/141945489/technical_drawing/Bosch-Sensortec-BNO055.pdf?src-supplier=Upverter; ComponentLink2Description: https://sigma.octopart.com:443/141945489/technical_drawing/Bosch-Sensortec-BNO055.pdf?src-supplier=Upverter; ComponentLink3URL: https://datasheet.octopart.com:443/BNO055-Bosch-Sensortec-datasheet-99733204.pdf?src-supplier=Upverter; ComponentLink3Description: https://datasheet.octopart.com:443/BNO055-Bosch-Sensortec-datasheet-99733204.pdf?src-supplier=Upverter; ComponentLink4URL: https://datasheet.octopart.com:443/BNO055-Bosch-Sensortec-datasheet-97529823.pdf?src-supplier=Upverter; ComponentLink4Description: https://datasheet.octopart.com:443/BNO055-Bosch-Sensortec-datasheet-97529823.pdf?src-supplier=Upverter; ComponentLink5URL: https://datasheet.octopart.com:443/BNO055-Bosch-Sensortec-datasheet-37535188.pdf?src-supplier=Upverter; ComponentLink5Description: https://datasheet.octopart.com:443/BNO055-Bosch-Sensortec-datasheet-37535188.pdf?src-supplier=Upverter; ComponentLink6URL: https://datasheet.octopart.com:443/BNO055-Bosch-Sensortec-datasheet-181953299.pdf?src-supplier=Future+Electronics; ComponentLink6Description: https://datasheet.octopart.com:443/BNO055-Bosch-Sensortec-datasheet-181953299.pdf?src-supplier=Future+Electronics; Supplier 1: Future Electronics; Supplier Part Number 1: BNO055
U2 = STM32F411RET6TR: RISC Microcontroller, 32-Bit, FLASH, CORTEX-M4 CPU, 100MHz, CMOS, PQFP64; Manufacturer_Name: STMicroelectronics; Geometry.Height: 1.6mm; ADC Channels (Resolution): 16-Ch 12-Bit; Core Architecture: ARM Cortex-M4; EEPROM Memory Size: 0B; Flash Memory Size: 512kB; Interface: SDIO, USB; Clock Frequency: 26MHz; Max Supply Current: 34.5mA; Max Supply Voltage: 3.6V; Min Supply Voltage: 1.7V; Nominal Supply Current: 1.8µA; Number of A/D Converters: 1; Number of Channels: 16; Number of I2C Channels: 3; Number of I/Os: 50; Number of SPI Channels: 5; Number of Timers/Counters: 2; Operating Supply Voltage: 3.3V; Peripherals: POR; RAM Size: 128kB; Manufacturer_Part_Number: STM32F411RET6TR; Mouser Part Number: 511-STM32F411RET6TR; Mouser Price/Stock: https://www.mouser.co.uk/ProductDetail/STMicroelectronics/STM32F411RET6TR?qs=BA62vJVifGpaf6czDatkOw%3D%3D; Arrow Part Number: STM32F411RET6TR; Arrow Price/Stock: https://www.arrow.com/en/products/stm32f411ret6tr/stmicroelectronics?utm_currency=USD&region=nac; Datasheet Link: https://www.st.com/resource/en/datasheet/stm32f411ce.pdf; Supplier 1: DigiKey; Supplier Part Number 1: 497-19349-1-ND; Manufacturer: STMicroelectronics; Manufacturer Part Number: STM32F411RET6TR; RoHS: Compliant; Category: Microcontrollers; Stock: 34; Pricing: 1=6.84, 10=5.258, 25=4.864, 100=4.4302, 250=4.2442 (USD); Case/Package: LFQFP; China RoHS: Compliant; Country of Origin: Mainland China, Malaysia, Taiwan; Export Control Classification Number (ECCN) Code: 3A991.A.2; Frequency: 100MHz; Height - Seated (Max): 1.6mm; Harmonized Tariff Schedule (HTS) Code: 8542.31.00.25; Introduction Date: 2014-06-19; Length: 10mm; Lifecycle Status: Production; Max Operating Temperature: 85°C; Memory Format: FLASH; Min Operating Temperature: -40°C; Number of Interrupts: 16; Number of Terminals: 64; Number of USART Channels: 3; Packaging: Tape and Reel; REACH SVHC: Yes; Temperature Grade: Industrial; Terminal Pitch: 500µm; Width: 10mm; ComponentLink1URL: https://datasheet.octopart.com:443/STM32F411RET6TR-STMicroelectronics-datasheet-41919523.pdf?src-supplier=Upverter; ComponentLink1Description: https://datasheet.octopart.com:443/STM32F411RET6TR-STMicroelectronics-datasheet-41919523.pdf?src-supplier=Upverter; ComponentLink2URL: https://datasheet.octopart.com:443/STM32F411RET6TR-STMicroelectronics-datasheet-27102711.pdf?src-supplier=STMicroelectronics; ComponentLink2Description: https://datasheet.octopart.com:443/STM32F411RET6TR-STMicroelectronics-datasheet-27102711.pdf?src-supplier=STMicroelectronics; ComponentLink3URL: https://datasheet.octopart.com:443/STM32F411RET6TR-STMicroelectronics-datasheet-82511007.pdf?src-supplier=SHENGYU+ELECTRONICS; ComponentLink3Description: https://datasheet.octopart.com:443/STM32F411RET6TR-STMicroelectronics-datasheet-82511007.pdf?src-supplier=SHENGYU+ELECTRONICS
U3 U4 = DRV8231ADSGR: 50-V, 4.1-A H-bridge motor driver with integrated current regulation & current-sense feedback 8-SO PowerPAD -40 to 150; Manufacturer: Texas Instruments; Manufacturer Lifecycle Status: ACTIVE; Number of Channels: 1; Supplier 1: DigiKey; Supplier Part Number 1: 296-DRV8251ADDARCT-ND; Manufacturer Part Number: DRV8251ADDAR; RoHS: Compliant; Category: Motor Drivers; Stock: 6728; Pricing: 1=2.25, 10=1.665, 25=1.5196, 100=1.3591, 250=1.28268, 500=1.2366, 1000=1.19866 (USD); Height: 1.7mm; Length: 4.89mm; Lifecycle Status: Production; Pins: 8; Thickness: 1.48mm; Width: 3.9mm; ComponentLink2URL: https://datasheet.octopart.com:443/DRV8251ADDAR-Texas-Instruments-datasheet-165811235.pdf?src-supplier=ODG+(Origin+Data+Global); ComponentLink2Description: https://datasheet.octopart.com:443/DRV8251ADDAR-Texas-Instruments-datasheet-165811235.pdf?src-supplier=ODG+(Origin+Data+Global); ComponentLink3URL: https://datasheet.octopart.com:443/DRV8251ADDAR-Texas-Instruments-datasheet-178830255.pdf?src-supplier=LCSC; ComponentLink3Description: https://datasheet.octopart.com:443/DRV8251ADDAR-Texas-Instruments-datasheet-178830255.pdf?src-supplier=LCSC; ComponentLink4URL: http://sigma.octopart.com:80/reach_statement/Texas-Instruments-company-64.pdf?src-supplier=Compliance+Statements; ComponentLink4Description: http://sigma.octopart.com:80/reach_statement/Texas-Instruments-company-64.pdf?src-supplier=Compliance+Statements; ComponentLink5URL: http://sigma.octopart.com:80/conflict_mineral_statement/Texas-Instruments-company-63.pdf?src-supplier=Compliance+Statements; ComponentLink5Description: http://sigma.octopart.com:80/conflict_mineral_statement/Texas-Instruments-company-63.pdf?src-supplier=Compliance+Statements
  U3: ComponentLink1URL: https://octopart.com:443/opatz8j6/c1?t=7oUKRKkqwphIgwbtNbBc67owxNExsRdXrlPd_sBHnIKi_-H_t5suGGb5ZND4dBnSpUprWKEI1GJbY9qXDqE5wQb54uF2_8cCtleVlQfIIUgNQal_f1XPPx41JvHuqZD8P686xjzcz29DRRHUNopMHhQt6Aun-Q7UtO3W5-WTfdM8Hgmb8mq14zsLVaf9BYQF4kWKKP1vJII8XnOUC2yw6q8reuoLVzCQkwxpJfqf3XVhJXuLLQnsgXc5Zvxap5_H4ldeiGenDzkE71_iLZElw_4WjFZC3t3acjBfqrvQXTF1uguQZXqacgCm7W9f8tf9yLwhTR4Pgx-V1MzeuQJKKgipRE97MCy_LxstRkR3sNYpAlDTbjfaO7-AnMMibebzN-J1q-mELw&src-supplier=Texas+Instruments; ComponentLink1Description: https://octopart.com:443/opatz8j6/c1?t=7oUKRKkqwphIgwbtNbBc67owxNExsRdXrlPd_sBHnIKi_-H_t5suGGb5ZND4dBnSpUprWKEI1GJbY9qXDqE5wQb54uF2_8cCtleVlQfIIUgNQal_f1XPPx41JvHuqZD8P686xjzcz29DRRHUNopMHhQt6Aun-Q7UtO3W5-WTfdM8Hgmb8mq14zsLVaf9BYQF4kWKKP1vJII8XnOUC2yw6q8reuoLVzCQkwxpJfqf3XVhJXuLLQnsgXc5Zvxap5_H4ldeiGenDzkE71_iLZElw_4WjFZC3t3acjBfqrvQXTF1uguQZXqacgCm7W9f8tf9yLwhTR4Pgx-V1MzeuQJKKgipRE97MCy_LxstRkR3sNYpAlDTbjfaO7-AnMMibebzN-J1q-mELw&src-supplier=Texas+Instruments
  U4: ComponentLink1URL: https://octopart.com:443/opatz8j6/c1?t=Gj9IDkYE8sfDnI1AQ8OPnHqI7H6pSVf5TjQsrTRNSfFb2i9Q4E7y6UU0tVNpv_uoOppLbHDr29Be0S0k4dsXsBj-9gVok0f8TON-7LqCOQIvnQH5XUUSK6qV1XxCoSC3IIyjzOJDbsjsD30C2G81fOEWgdAi9tTEL0YTqVgBlAxJkPUr1oD_orBTcTOlqy8LQjJndhkQh3dsRqZAKQuzGR54t0CVOThOeZ_uUhCqRvIOoCKY4GRRNIIIiOkvYVDQVjZDrzRxciuayJCFmhWe2bbu2HGZQ9cORHH4HLGk37RopXHYscM4bRc45aOsixNwKVZGCHcT521wi6UN6PXFqU74gjaycJJAvUxioH527eZvfdREOqnlpyx5aqlzelpdWEqVmK_K5A&src-supplier=Texas+Instruments; ComponentLink1Description: https://octopart.com:443/opatz8j6/c1?t=Gj9IDkYE8sfDnI1AQ8OPnHqI7H6pSVf5TjQsrTRNSfFb2i9Q4E7y6UU0tVNpv_uoOppLbHDr29Be0S0k4dsXsBj-9gVok0f8TON-7LqCOQIvnQH5XUUSK6qV1XxCoSC3IIyjzOJDbsjsD30C2G81fOEWgdAi9tTEL0YTqVgBlAxJkPUr1oD_orBTcTOlqy8LQjJndhkQh3dsRqZAKQuzGR54t0CVOThOeZ_uUhCqRvIOoCKY4GRRNIIIiOkvYVDQVjZDrzRxciuayJCFmhWe2bbu2HGZQ9cORHH4HLGk37RopXHYscM4bRc45aOsixNwKVZGCHcT521wi6UN6PXFqU74gjaycJJAvUxioH527eZvfdREOqnlpyx5aqlzelpdWEqVmK_K5A&src-supplier=Texas+Instruments
U5 = W25Q128JVSIQ: NOR Flash Serial (SPI, Dual SPI, Quad SPI) 3.3V 128M-bit 16M x 8 6ns 8-Pin SOIC Tube; Manufacturer: Winbond; Frequency: 104MHz; Clock Frequency: 133MHz; Max Supply Current: 20mA; Max Supply Voltage: 3.6V; Memory Size: 16MB; Min Supply Voltage: 2.7V; Number of Circuits: 1; Operating Supply Voltage: 3V; Supplier 1: DigiKey; Supplier Part Number 1: W25Q128JVSIQ-ND; Manufacturer Part Number: W25Q128JVSIQ; RoHS: Compliant; Category: Flash; Pricing: 1=2.24, 10=2.097, 25=2.0376, 90=1.95322, 180=1.90739, 270=1.88059, 540=1.83506, 1080=1.78986, 5040=1.69147 (USD); Ambient Temperature Range High: 85°C; Case/Package: SOP; China RoHS: Compliant; Export Control Classification Number (ECCN) Code: EAR99; Height: 2.16mm; Height - Seated (Max): 2.16mm; Harmonized Tariff Schedule (HTS) Code: 8542.32.00.51; Interface: Serial; Introduction Date: 2016-11-14; Length: 5.23mm; Lifecycle Status: Production; Max Operating Temperature: 85°C; Memory Format: FLASH; Min Operating Temperature: -40°C; Number of Terminals: 8; REACH SVHC: Yes; Schedule B: 8542320070, 8542320070|8542320070, 8542320070|8542320070|8542320070, 8542320070|8542320070|8542320070|8542320070; Temperature Grade: Industrial; Terminal Pitch: 1.27mm; Width: 5.23mm; ComponentLink1URL: https://datasheet.octopart.com:443/W25Q128JVSIQ-Winbond-datasheet-181529389.pdf?src-supplier=ODG+(Origin+Data+Global); ComponentLink1Description: https://datasheet.octopart.com:443/W25Q128JVSIQ-Winbond-datasheet-181529389.pdf?src-supplier=ODG+(Origin+Data+Global); ComponentLink2URL: https://sigma.octopart.com:443/138898685/technical_drawing/Winbond-W25Q128JVSIQ.pdf?src-supplier=Upverter; ComponentLink2Description: https://sigma.octopart.com:443/138898685/technical_drawing/Winbond-W25Q128JVSIQ.pdf?src-supplier=Upverter; ComponentLink3URL: https://datasheet.octopart.com:443/W25Q128JVSIQ-Winbond-datasheet-138898757.pdf?src-supplier=Upverter; ComponentLink3Description: https://datasheet.octopart.com:443/W25Q128JVSIQ-Winbond-datasheet-138898757.pdf?src-supplier=Upverter; ComponentLink4URL: https://datasheet.octopart.com:443/W25Q128JVSIQ-Winbond-datasheet-138104337.pdf?src-supplier=Augswan; ComponentLink4Description: https://datasheet.octopart.com:443/W25Q128JVSIQ-Winbond-datasheet-138104337.pdf?src-supplier=Augswan
X1 = XTAL-2P: Crystal 0.032768MHz ±20ppm (Tol) 12.5pF Flexural 70000Ohm 2-Pin CSMD T/R; Manufacturer: Abracon; Manufacturer Part Number: ABS07-32.768KHZ-T; ESR (Equivalent Series Resistance): 70kΩ; Frequency: 32.768kHz; Frequency Stability: 144ppm; Frequency Tolerance: 0.002%; Value: 32k768Hz; Supplier 1: Master Electronics; Supplier Part Number 1: ABS07-32.768KHZ-T; RoHS: Compliant; Category: Crystals; Stock: 1691934; Pricing: 3000=0.199, 6000=0.184, 9000=0.179, 12000=0.155 (USD); Case/Package: CSMD; China RoHS: Compliant; Country of Origin: Mainland China; Depth: 1.5mm; Export Control Classification Number (ECCN) Code: EAR99; Height: 900µm; Harmonized Tariff Schedule (HTS) Code: 8541.60.00.10; Introduction Date: 2007-01-08; Lead Free: Lead Free; Length: 3.2mm; Lifecycle Status: Production; Load Capacitance: 12.5pF; Max Operating Temperature: 85°C; Min Operating Temperature: -40°C; Mounting Technology: Surface Mount; Pins: 2; Packaging: Tape and Reel; Radiation Hardening: No; REACH SVHC: Yes; Schedule B: 8541600025, 8541600025|8541600025, 8541600025|8541600025|8541600025, 8541600025|8541600025|8541600025|8541600025; ESR: 70kΩ; Termination: SMD/SMT; Tolerance: 0.002%; Width: 1.5494mm; ComponentLink1URL: https://datasheet.octopart.com:443/ABS07-32.768KHZ-T-Abracon-datasheet-166693031.pdf?src-supplier=JRH+Electronics; ComponentLink1Description: https://datasheet.octopart.com:443/ABS07-32.768KHZ-T-Abracon-datasheet-166693031.pdf?src-supplier=JRH+Electronics; ComponentLink2URL: https://datasheet.octopart.com:443/ABS07-32.768KHZ-T-Abracon-datasheet-103422647.pdf?src-supplier=JRH+Electronics; ComponentLink2Description: https://datasheet.octopart.com:443/ABS07-32.768KHZ-T-Abracon-datasheet-103422647.pdf?src-supplier=JRH+Electronics; ComponentLink3URL: https://datasheet.octopart.com:443/ABS07-32.768KHZ-T-Abracon-datasheet-12512028.pdf?src-supplier=Upverter; ComponentLink3Description: https://datasheet.octopart.com:443/ABS07-32.768KHZ-T-Abracon-datasheet-12512028.pdf?src-supplier=Upverter; ComponentLink4URL: https://datasheet.octopart.com:443/ABS07-32.768KHZ-T-Abracon-datasheet-10031075.pdf?src-supplier=Upverter; ComponentLink4Description: https://datasheet.octopart.com:443/ABS07-32.768KHZ-T-Abracon-datasheet-10031075.pdf?src-supplier=Upverter; ComponentLink5URL: https://datasheet.octopart.com:443/ABS07-32.768KHZ-T-Abracon-datasheet-8326266.pdf?src-supplier=Upverter; ComponentLink5Description: https://datasheet.octopart.com:443/ABS07-32.768KHZ-T-Abracon-datasheet-8326266.pdf?src-supplier=Upverter; ComponentLink6URL: https://datasheet.octopart.com:443/ABS07-32.768KHZ-T-Abracon-datasheet-121082.pdf?src-supplier=Upverter; ComponentLink6Description: https://datasheet.octopart.com:443/ABS07-32.768KHZ-T-Abracon-datasheet-121082.pdf?src-supplier=Upverter; ComponentLink7URL: https://datasheet.octopart.com:443/ABS07-32.768KHZ-T-Abracon-datasheet-41191559.pdf?src-supplier=element14+APAC; ComponentLink7Description: https://datasheet.octopart.com:443/ABS07-32.768KHZ-T-Abracon-datasheet-41191559.pdf?src-supplier=element14+APAC; ComponentLink8URL: https://datasheet.octopart.com:443/ABS07-32.768KHZ-T-Abracon-datasheet-15206620.pdf?src-supplier=Newark; ComponentLink8Description: https://datasheet.octopart.com:443/ABS07-32.768KHZ-T-Abracon-datasheet-15206620.pdf?src-supplier=Newark; ComponentLink9URL: https://datasheet.octopart.com:443/ABS07-32.768KHZ-T-Abracon-datasheet-37124839.pdf?src-supplier=Farnell; ComponentLink9Description: https://datasheet.octopart.com:443/ABS07-32.768KHZ-T-Abracon-datasheet-37124839.pdf?src-supplier=Farnell; ComponentLink10URL: https://datasheet.octopart.com:443/ABS07-32.768KHZ-T-Abracon-datasheet-128558976.pdf?src-supplier=X-ON; ComponentLink10Description: https://datasheet.octopart.com:443/ABS07-32.768KHZ-T-Abracon-datasheet-128558976.pdf?src-supplier=X-ON; ComponentLink11URL: https://datasheet.octopart.com:443/ABS07-32.768KHZ-T-Abracon-datasheet-49826663.pdf?src-supplier=TME; ComponentLink11Description: https://datasheet.octopart.com:443/ABS07-32.768KHZ-T-Abracon-datasheet-49826663.pdf?src-supplier=TME; ComponentLink12URL: https://datasheet.octopart.com:443/ABS07-32.768KHZ-T-Abracon-datasheet-15994676.pdf?src-supplier=TME; ComponentLink12Description: https://datasheet.octopart.com:443/ABS07-32.768KHZ-T-Abracon-datasheet-15994676.pdf?src-supplier=TME; ComponentLink13URL: http://sigma.octopart.com:80/conflict_mineral_statement/Abracon-company-27.pdf?src-supplier=Compliance+Statements; ComponentLink13Description: http://sigma.octopart.com:80/conflict_mineral_statement/Abracon-company-27.pdf?src-supplier=Compliance+Statements